# Altium schematic sheet Buck_Converters.SchDoc
size 381 x 241 mm; SheetNumber: 2; SheetTotal: 2
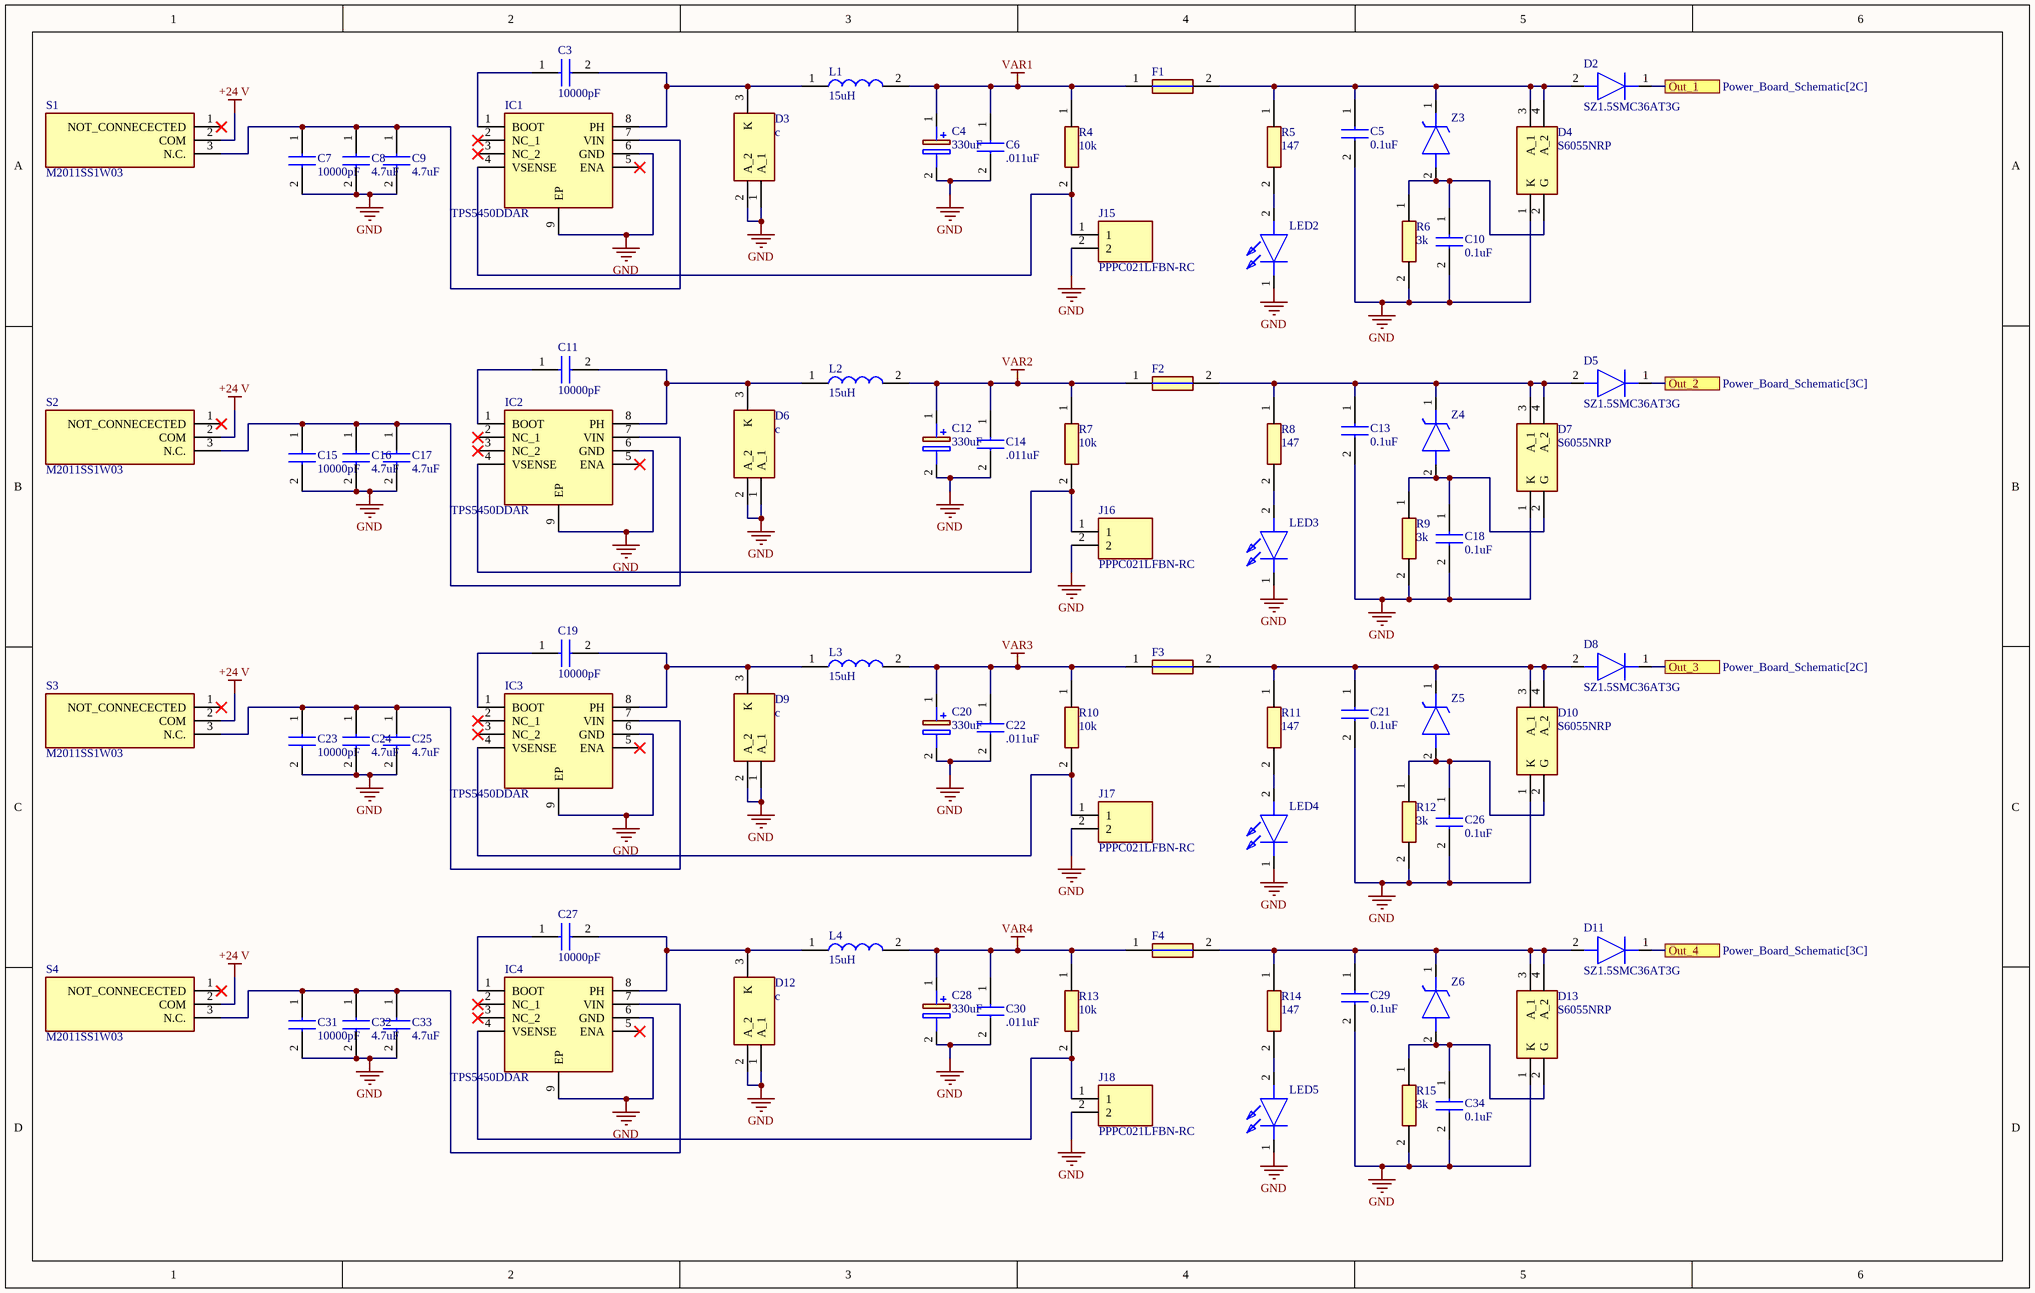
[diagram p0: Buck_Converters.SchDoc]

## Parts
C3  10000pF  [CAPC2012X95N]
C4  330uF  [T521X]
C5  0.1uF  [CAPC3216X190N]
C6  .011uF  [CAPC3216X95N]
C7  10000pF  [CAPC2012X95N]
C8  4.7uF  [CAPC3216X180N]
C9  4.7uF  [CAPC3216X180N]
C10  0.1uF  [CAPC3216X190N]
C11  10000pF  [CAPC2012X95N]
C12  330uF  [T521X]
C13  0.1uF  [CAPC3216X190N]
C14  .011uF  [CAPC3216X95N]
C15  10000pF  [CAPC2012X95N]
C16  4.7uF  [CAPC3216X180N]
C17  4.7uF  [CAPC3216X180N]
C18  0.1uF  [CAPC3216X190N]
C19  10000pF  [CAPC2012X95N]
C20  330uF  [T521X]
C21  0.1uF  [CAPC3216X190N]
C22  .011uF  [CAPC3216X95N]
C23  10000pF  [CAPC2012X95N]
C24  4.7uF  [CAPC3216X180N]
C25  4.7uF  [CAPC3216X180N]
C26  0.1uF  [CAPC3216X190N]
C27  10000pF  [CAPC2012X95N]
C28  330uF  [T521X]
C29  0.1uF  [CAPC3216X190N]
C30  .011uF  [CAPC3216X95N]
C31  10000pF  [CAPC2012X95N]
C32  4.7uF  [CAPC3216X180N]
C33  4.7uF  [CAPC3216X180N]
C34  0.1uF  [CAPC3216X190N]
D2  SZ1.5SMC36AT3G  [DIOM7958X256N]
D3  c  [PMEG045T100EPEZ]
D4  S6055NRP  [S6055NRP]
D5  SZ1.5SMC36AT3G  [DIOM7958X256N]
D6  c  [PMEG045T100EPEZ]
D7  S6055NRP  [S6055NRP]
D8  SZ1.5SMC36AT3G  [DIOM7958X256N]
D9  c  [PMEG045T100EPEZ]
D10  S6055NRP  [S6055NRP]
D11  SZ1.5SMC36AT3G  [DIOM7958X256N]
D12  c  [PMEG045T100EPEZ]
D13  S6055NRP  [S6055NRP]
F1  MFU0805FF05000P100  [FUSC2012X55N]  (value not drawn)
F2  MFU0805FF05000P100  [FUSC2012X55N]  (value not drawn)
F3  MFU0805FF05000P100  [FUSC2012X55N]  (value not drawn)
F4  MFU0805FF05000P100  [FUSC2012X55N]  (value not drawn)
IC1  TPS5450DDAR  [SOIC127P600X170-9N]
IC2  TPS5450DDAR  [SOIC127P600X170-9N]
IC3  TPS5450DDAR  [SOIC127P600X170-9N]
IC4  TPS5450DDAR  [SOIC127P600X170-9N]
J15  PPPC021LFBN-RC  [RHDR2W80P0X254_1X2_558X254X850P]
J16  PPPC021LFBN-RC  [RHDR2W80P0X254_1X2_558X254X850P]
J17  PPPC021LFBN-RC  [RHDR2W80P0X254_1X2_558X254X850P]
J18  PPPC021LFBN-RC  [RHDR2W80P0X254_1X2_558X254X850P]
L1  15uH  [WE-PD_1260/1245/1280/121054]
L2  15uH  [WE-PD_1260/1245/1280/121054]
L3  15uH  [WE-PD_1260/1245/1280/121054]
L4  15uH  [WE-PD_1260/1245/1280/121054]
LED2  CMD15-21VYC_TR8  [LEDC3215X130N]  (value not drawn)
LED3  CMD15-21VYC_TR8  [LEDC3215X130N]  (value not drawn)
LED4  CMD15-21VYC_TR8  [LEDC3215X130N]  (value not drawn)
LED5  CMD15-21VYC_TR8  [LEDC3215X130N]  (value not drawn)
R4  10k  [ERJP08_(1206)]
R5  147  [RESC3216X70N]
R6  3k  [ERJP08_(1206)]
R7  10k  [ERJP08_(1206)]
R8  147  [RESC3216X70N]
R9  3k  [ERJP08_(1206)]
R10  10k  [ERJP08_(1206)]
R11  147  [RESC3216X70N]
R12  3k  [ERJP08_(1206)]
R13  10k  [ERJP08_(1206)]
R14  147  [RESC3216X70N]
R15  3k  [ERJP08_(1206)]
S1  M2011SS1W03  [M2011SS1W03]
S2  M2011SS1W03  [M2011SS1W03]
S3  M2011SS1W03  [M2011SS1W03]
S4  M2011SS1W03  [M2011SS1W03]
Z3  SMBJ5352B-TP  [DIOM5336X262N]  (value not drawn)
Z4  SMBJ5352B-TP  [DIOM5336X262N]  (value not drawn)
Z5  SMBJ5352B-TP  [DIOM5336X262N]  (value not drawn)
Z6  SMBJ5352B-TP  [DIOM5336X262N]  (value not drawn)

## Ports
Out_1 (see Power_Board_Schematic[2C]), Out_2 (see Power_Board_Schematic[3C]), Out_3 (see Power_Board_Schematic[2C]), Out_4 (see Power_Board_Schematic[3C])

## Nets
+24 V: S1.2(COM) S2.2(COM) S3.2(COM) S4.2(COM)
GND: C4.2(-) C5.2 C6.2 C7.2 C8.2 C9.2 C10.2 C12.2(-) C13.2 C14.2 C15.2 C16.2 C17.2 C18.2 C20.2(-) C21.2 C22.2 C23.2 C24.2 C25.2 C26.2 C28.2(-) C29.2 C30.2 C31.2 C32.2 C33.2 C34.2 D3.1(A_1) D3.2(A_2) D4.1(K) D6.1(A_1) D6.2(A_2) D7.1(K) D9.1(A_1) D9.2(A_2) D10.1(K) D12.1(A_1) D12.2(A_2) D13.1(K) IC1.6(GND) IC1.9(EP) IC2.6(GND) IC2.9(EP) IC3.6(GND) IC3.9(EP) IC4.6(GND) IC4.9(EP) J15.2 J16.2 J17.2 J18.2 LED2.1(K) LED3.1(K) LED4.1(K) LED5.1(K) R6.2 R9.2 R12.2 R15.2
VAR1: C4.1(+) C6.1 F1.1 L1.2 R4.1
VAR2: C12.1(+) C14.1 F2.1 L2.2 R7.1
VAR3: C20.1(+) C22.1 F3.1 L3.2 R10.1
VAR4: C28.1(+) C30.1 F4.1 L4.2 R13.1
Out_1: D2.1(K) ; port Out_1
Out_2: D5.1(K) ; port Out_2
Out_3: D8.1(K) ; port Out_3
Out_4: D11.1(K) ; port Out_4
NetC3_1: C3.1 IC1.1(BOOT)
NetC3_2: C3.2 D3.3(K) IC1.8(PH) L1.1
NetC5_1: C5.1 D2.2(A) D4.3(A_1) D4.4(A_2) F1.2 R5.1 Z3.1(K)
NetC7_1: C7.1 C8.1 C9.1 IC1.7(VIN) S1.3(N.C.)
NetC10_1: C10.1 D4.2(G) R6.1 Z3.2(A)
NetC11_1: C11.1 IC2.1(BOOT)
NetC11_2: C11.2 D6.3(K) IC2.8(PH) L2.1
NetC13_1: C13.1 D5.2(A) D7.3(A_1) D7.4(A_2) F2.2 R8.1 Z4.1(K)
NetC15_1: C15.1 C16.1 C17.1 IC2.7(VIN) S2.3(N.C.)
NetC18_1: C18.1 D7.2(G) R9.1 Z4.2(A)
NetC19_1: C19.1 IC3.1(BOOT)
NetC19_2: C19.2 D9.3(K) IC3.8(PH) L3.1
NetC21_1: C21.1 D8.2(A) D10.3(A_1) D10.4(A_2) F3.2 R11.1 Z5.1(K)
NetC23_1: C23.1 C24.1 C25.1 IC3.7(VIN) S3.3(N.C.)
NetC26_1: C26.1 D10.2(G) R12.1 Z5.2(A)
NetC27_1: C27.1 IC4.1(BOOT)
NetC27_2: C27.2 D12.3(K) IC4.8(PH) L4.1
NetC29_1: C29.1 D11.2(A) D13.3(A_1) D13.4(A_2) F4.2 R14.1 Z6.1(K)
NetC31_1: C31.1 C32.1 C33.1 IC4.7(VIN) S4.3(N.C.)
NetC34_1: C34.1 D13.2(G) R15.1 Z6.2(A)
NetIC1_4: IC1.4(VSENSE) J15.1 R4.2
NetIC2_4: IC2.4(VSENSE) J16.1 R7.2
NetIC3_4: IC3.4(VSENSE) J17.1 R10.2
NetIC4_4: IC4.4(VSENSE) J18.1 R13.2
NetLED2_2: LED2.2(A) R5.2
NetLED3_2: LED3.2(A) R8.2
NetLED4_2: LED4.2(A) R11.2
NetLED5_2: LED5.2(A) R14.2

Not connected (* = marked no-connect by the designer): IC1 2(NC_1)* 3(NC_2)* 5(ENA)*; IC2 2(NC_1)* 3(NC_2)* 5(ENA)*; IC3 2(NC_1)* 3(NC_2)* 5(ENA)*; IC4 2(NC_1)* 3(NC_2)* 5(ENA)*; S1 1(NOT_CONNECECTED)*; S2 1(NOT_CONNECECTED)*; S3 1(NOT_CONNECECTED)*; S4 1(NOT_CONNECECTED)*

## Library data of the parts
C3 C7 C11 C15 C19 C23 C27 C31 = GRM2195C1H103JA01D: Capacitor; Manufacturer_Name: Murata Electronics; Datasheet Link: https://psearch.en.murata.com/capacitor/product/GRM2195C1H103JA01%23.html; Height: 0.95mm; Manufacturer_Part_Number: GRM2195C1H103JA01D; Mouser Part Number: 81-GRM215C1H103JA01D; Mouser Price/Stock: https://www.mouser.co.uk/ProductDetail/Murata-Electronics/GRM2195C1H103JA01D?qs=WuXK2ZU3Btf4YpEuFd2mEg%3D%3D; Arrow Part Number: GRM2195C1H103JA01D; Arrow Price/Stock: https://www.arrow.com/en/products/grm2195c1h103ja01d/murata-manufacturing?region=nac; VALUE: 10000pF
C4 C12 C20 C28 = T521X337M016ATE025: Capacitor Polarised; Manufacturer_Name: KEMET; Datasheet Link: https://content.kemet.com/datasheets/KEM_T2076_T52X-530.pdf; Height: 4.3mm; Manufacturer_Part_Number: T521X337M016ATE025; Mouser Part Number: 80-T521X337M16ATE25; Mouser Price/Stock: https://www.mouser.co.uk/ProductDetail/KEMET/T521X337M016ATE025?qs=1gHfTFoodzYrClDYqjFI7g%3D%3D; Arrow Part Number: T521X337M016ATE025; Arrow Price/Stock: https://www.arrow.com/en/products/t521x337m016ate025/kemet-corporation
C5 C10 C13 C18 C21 C26 C29 C34 = UMJ316BB7104KL8T: Capacitor; Manufacturer_Name: TAIYO YUDEN; Datasheet Link: https://drive.google.com/file/d/1fM7Vb6Bhj_-C9r1lyMtxyck3QU2kMTfJ/view?usp=sharing; Height: 1.9mm; Manufacturer_Part_Number: UMJ316BB7104KL8T; Mouser Part Number: 963-UMJ316BB7104KL8T; Mouser Price/Stock: https://www.mouser.co.uk/ProductDetail/TAIYO-YUDEN/UMJ316BB7104KL8T?qs=DPoM0jnrROVD2ECNn%252BkKUw%3D%3D
C6 C14 C22 C30 = GRM3195C1H113JA01D: Capacitor; Manufacturer_Name: Murata Electronics; Datasheet Link: https://datasheet.datasheetarchive.com/originals/distributors/Datasheets_SAMA/ec4f1577dddcc7a13ddad897a28002d3.pdf; Height: 0.95mm; Manufacturer_Part_Number: GRM3195C1H113JA01D; Mouser Part Number: 81-GRM3195C1H113JA1D; Mouser Price/Stock: https://www.mouser.co.uk/ProductDetail/Murata-Electronics/GRM3195C1H113JA01D?qs=2xc37bZVjFj5Q80Tqu7yZg%3D%3D; Arrow Part Number: GRM3195C1H113JA01D; Arrow Price/Stock: https://www.arrow.com/en/products/grm3195c1h113ja01d/murata-manufacturing
C8 C9 C16 C17 C24 C25 C32 C33 = GRM31CR71H475KA12L: Capacitor; Manufacturer_Name: Murata Electronics; Datasheet Link: https://psearch.en.murata.com/capacitor/product/GRM31CR71H475KA12%23.html; Height: 1.8mm; Manufacturer_Part_Number: GRM31CR71H475KA12L; Mouser Part Number: 81-GRM31CR71H475KA2L; Mouser Price/Stock: https://www.mouser.co.uk/ProductDetail/Murata-Electronics/GRM31CR71H475KA12L?qs=QOxk%252BkhTc6I%252BVQUsJuOHog%3D%3D; Arrow Part Number: GRM31CR71H475KA12L; Arrow Price/Stock: https://www.arrow.com/en/products/grm31cr71h475ka12l/murata-manufacturing?region=nac
D2 D5 D8 D11 = SZ1.5SMC36AT3G: Diode; Manufacturer_Name: LITTELFUSE; Datasheet Link: https://ru.mouser.com/datasheet/2/240/Littelfuse_TVS_Diode_SZ1_5SMCxxA_Datasheet.pdf-1317300.pdf; Height: 2.56mm; Manufacturer_Part_Number: SZ1.5SMC36AT3G; Mouser Part Number: 863-SZ1.5SMC36AT3G; Mouser Price/Stock: https://www.mouser.co.uk/ProductDetail/Littelfuse/SZ1.5SMC36AT3G?qs=sK5eIuwOod6Y2gxgy5q9QA%3D%3D
D3 D6 D9 D12 = PMEG045T100EPEZ: Schottky Diode; Manufacturer_Name: Nexperia; Datasheet Link: https://assets.nexperia.com/documents/data-sheet/PMEG045T100EPE.pdf; Height: 0.99mm; Manufacturer_Part_Number: PMEG045T100EPEZ; Mouser Part Number: 771-PMEG045T100EPEZ; Mouser Price/Stock: https://www.mouser.co.uk/ProductDetail/Nexperia/PMEG045T100EPEZ?qs=sPbYRqrBIVkxZoatAqKzuA%3D%3D; Arrow Part Number: PMEG045T100EPEZ; Arrow Price/Stock: https://www.arrow.com/en/products/pmeg045t100epez/nexperia?region=nac
D4 D7 D10 D13 = S6055NRP: SCR; Manufacturer_Name: LITTELFUSE; Datasheet Link: https://componentsearchengine.com/Datasheets/1/S6055NRP.pdf; Height: 4.78mm; Manufacturer_Part_Number: S6055NRP; Mouser Part Number: 576-S6055NRP; Mouser Price/Stock: https://www.mouser.co.uk/ProductDetail/Littelfuse/S6055NRP?qs=HR2RnyOI4E77OLmw5dSgJg%3D%3D; Arrow Part Number: S6055NRP; Arrow Price/Stock: https://www.arrow.com/en/products/s6055nrp/littelfuse?region=nac
F1-F4 = MFU0805FF05000P100: Fuse; Manufacturer_Name: Vishay; Datasheet Link: https://componentsearchengine.com/Datasheets/2/MFU0805FF05000P100.pdf; Height: 0.55mm; Manufacturer_Part_Number: MFU0805FF05000P100; Mouser Part Number: 594-MFU0805FF05000P1; Mouser Price/Stock: https://www.mouser.co.uk/ProductDetail/Vishay-Beyschlag/MFU0805FF05000P100?qs=oI046glRurutd5qa47HBXA%3D%3D; Arrow Part Number: MFU0805FF05000P100; Arrow Price/Stock: https://www.arrow.com/en/products/mfu0805ff05000p100/vishay?region=nac
IC1-IC4 = TPS5450DDAR: Integrated Circuit; Manufacturer_Name: Texas Instruments; Datasheet Link: http://www.ti.com/general/docs/suppproductinfo.tsp?distId=10&gotoUrl=http%3A%2F%2Fwww.ti.com%2Flit%2Fgpn%2Ftps5450; Height: 1.7mm; Manufacturer_Part_Number: TPS5450DDAR; Mouser Part Number: 595-TPS5450DDAR; Mouser Price/Stock: https://www.mouser.co.uk/ProductDetail/Texas-Instruments/TPS5450DDAR?qs=h%2FYsCRHtaqPaz8oWBdcCug%3D%3D; Arrow Part Number: TPS5450DDAR; Arrow Price/Stock: https://www.arrow.com/en/products/tps5450ddar/texas-instruments?region=nac
J15-J18 = PPPC021LFBN-RC: Connector; Manufacturer_Name: Sullins; Datasheet Link: http://www.sullinscorp.com/drawings/78_P(N)PxCxxxLFBN-RC,_10492-H.pdf; Height: 8.5mm; Manufacturer_Part_Number: PPPC021LFBN-RC
L1-L4 = 7447709150: Inductor; Manufacturer_Name: Wurth Elektronik; Manufacturer_Part_Number: 7447709150; Mouser Part Number: 710-7447709150; Mouser Price/Stock: https://www.mouser.co.uk/ProductDetail/Wurth-Elektronik/7447709150?qs=E%2F%2FhvbtCqpNBWEYVOlGQNA%3D%3D
LED2-LED5 = CMD15-21VYC_TR8: LED; Manufacturer_Name: Visual Communications Company; Manufacturer_Part_Number: CMD15-21VYC/TR8; Datasheet Link: http://www.farnell.com/datasheets/2059686.pdf?_ga=1.173230763.922535262.1491543497; Height: 1.3mm; Mouser Part Number: 606-CMD15-21VYC; Mouser Price/Stock: https://www.mouser.com/Search/Refine.aspx?Keyword=606-CMD15-21VYC; Arrow Part Number: CMD15-21VYC/TR8; Arrow Price/Stock: https://www.arrow.com/en/products/cmd15-21vyctr8/visual-communications
R4 R7 R10 R13 = ERJ-P08J103V: Resistor; Manufacturer_Name: Panasonic; Datasheet Link: http://industrial.panasonic.com/cdbs/www-data/pdf/RDO0000/AOA0000C331.pdf; Height: 0.7mm; Manufacturer_Part_Number: ERJ-P08J103V; Mouser Part Number: 667-ERJ-P08J103V; Mouser Price/Stock: https://www.mouser.com/Search/Refine.aspx?Keyword=667-ERJ-P08J103V; Arrow Part Number: ERJ-P08J103V; Arrow Price/Stock: https://www.arrow.com/en/products/erj-p08j103v/panasonic
R5 R8 R11 R14 = RK73H2BTTD1470F: Resistor; Manufacturer_Name: KOA Speer; Datasheet Link: http://www.koaspeer.com/catimages/Products/RK73H/RK73H.pdf; Height: 0.7mm; Manufacturer_Part_Number: RK73H2BTTD1470F
R6 R9 R12 R15 = ERJ-P08J302V: Resistor; Manufacturer_Name: Panasonic; Datasheet Link: http://industrial.panasonic.com/cdbs/www-data/pdf/RDO0000/AOA0000C331.pdf; Height: 0.7mm; Manufacturer_Part_Number: ERJ-P08J302V; Mouser Part Number: 667-ERJ-P08J302V; Mouser Price/Stock: https://www.mouser.com/Search/Refine.aspx?Keyword=667-ERJ-P08J302V
S1-S4 = M2011SS1W03: Switch; Manufacturer_Name: NKK Switches; Datasheet Link: https://www.arrow.com/en/products/m2011ss1w03/nkk-switches; Height: 28.8mm; Manufacturer_Part_Number: M2011SS1W03; Mouser Part Number: 633-M2011SS1W03; Mouser Price/Stock: https://www.mouser.co.uk/ProductDetail/NKK-Switches/M2011SS1W03?qs=tJISjqPx8tixbHF6uPAmWg%3D%3D; Arrow Part Number: M2011SS1W03; Arrow Price/Stock: https://www.arrow.com/en/products/m2011ss1w03/nkk-switches?region=nac
Z3-Z6 = SMBJ5352B-TP: Zener Diode; Manufacturer_Name: MCC; Datasheet Link: https://www.mccsemi.com/pdf/Products/SMBJ5338B-SMBJ5388B(SMB).pdf; Height: 2.62mm; Manufacturer_Part_Number: SMBJ5352B-TP; Mouser Part Number: 833-SMBJ5352B-TP; Mouser Price/Stock: https://www.mouser.co.uk/ProductDetail/Micro-Commercial-Components-MCC/SMBJ5352B-TP?qs=ZNK0BnemlqH0SS%2FVsVpXVw%3D%3D; Arrow Part Number: SMBJ5352B-TP; Arrow Price/Stock: https://www.arrow.com/en/products/smbj5352b-tp/micro-commercial-components